# Altium schematic sheet [00]_DoteXGroup.SchDoc
size A
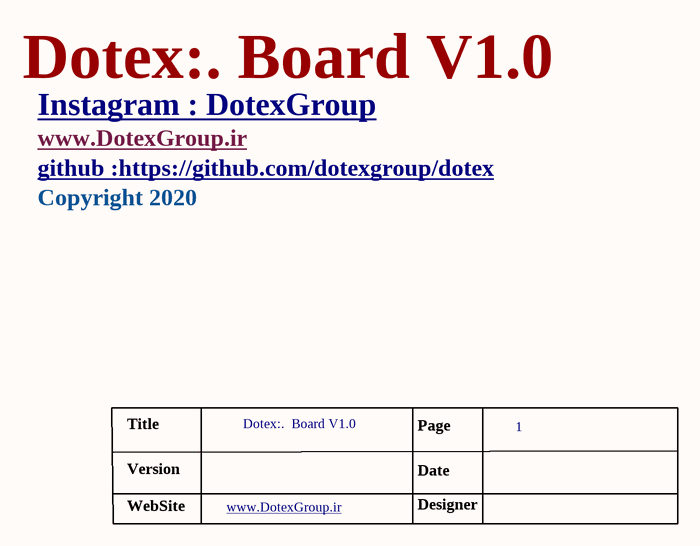
[diagram p0: [00]_DoteXGroup.SchDoc]

## Notes on the sheet
- Dotex:. Board V1.0
- Instagram : DotexGroup <https://www.instagram.com/dotexgroup/>
- www.DotexGroup.ir <http://www.DotexGroup.ir>
- Copyright 2020
- github :https://github.com/dotexgroup/dotex <https://github.com/dotexgroup/dotex>
- Title
- Dotex:.  Board V1.0
- Page
- 1
- Version
- WebSite
- www.DotexGroup.ir <http://www.DotexGwww.DotexGroup.irroup.ir>
- Date
- Designer